# EAGLE design RfLink-ESPlink (EAGLE 8.3.2)
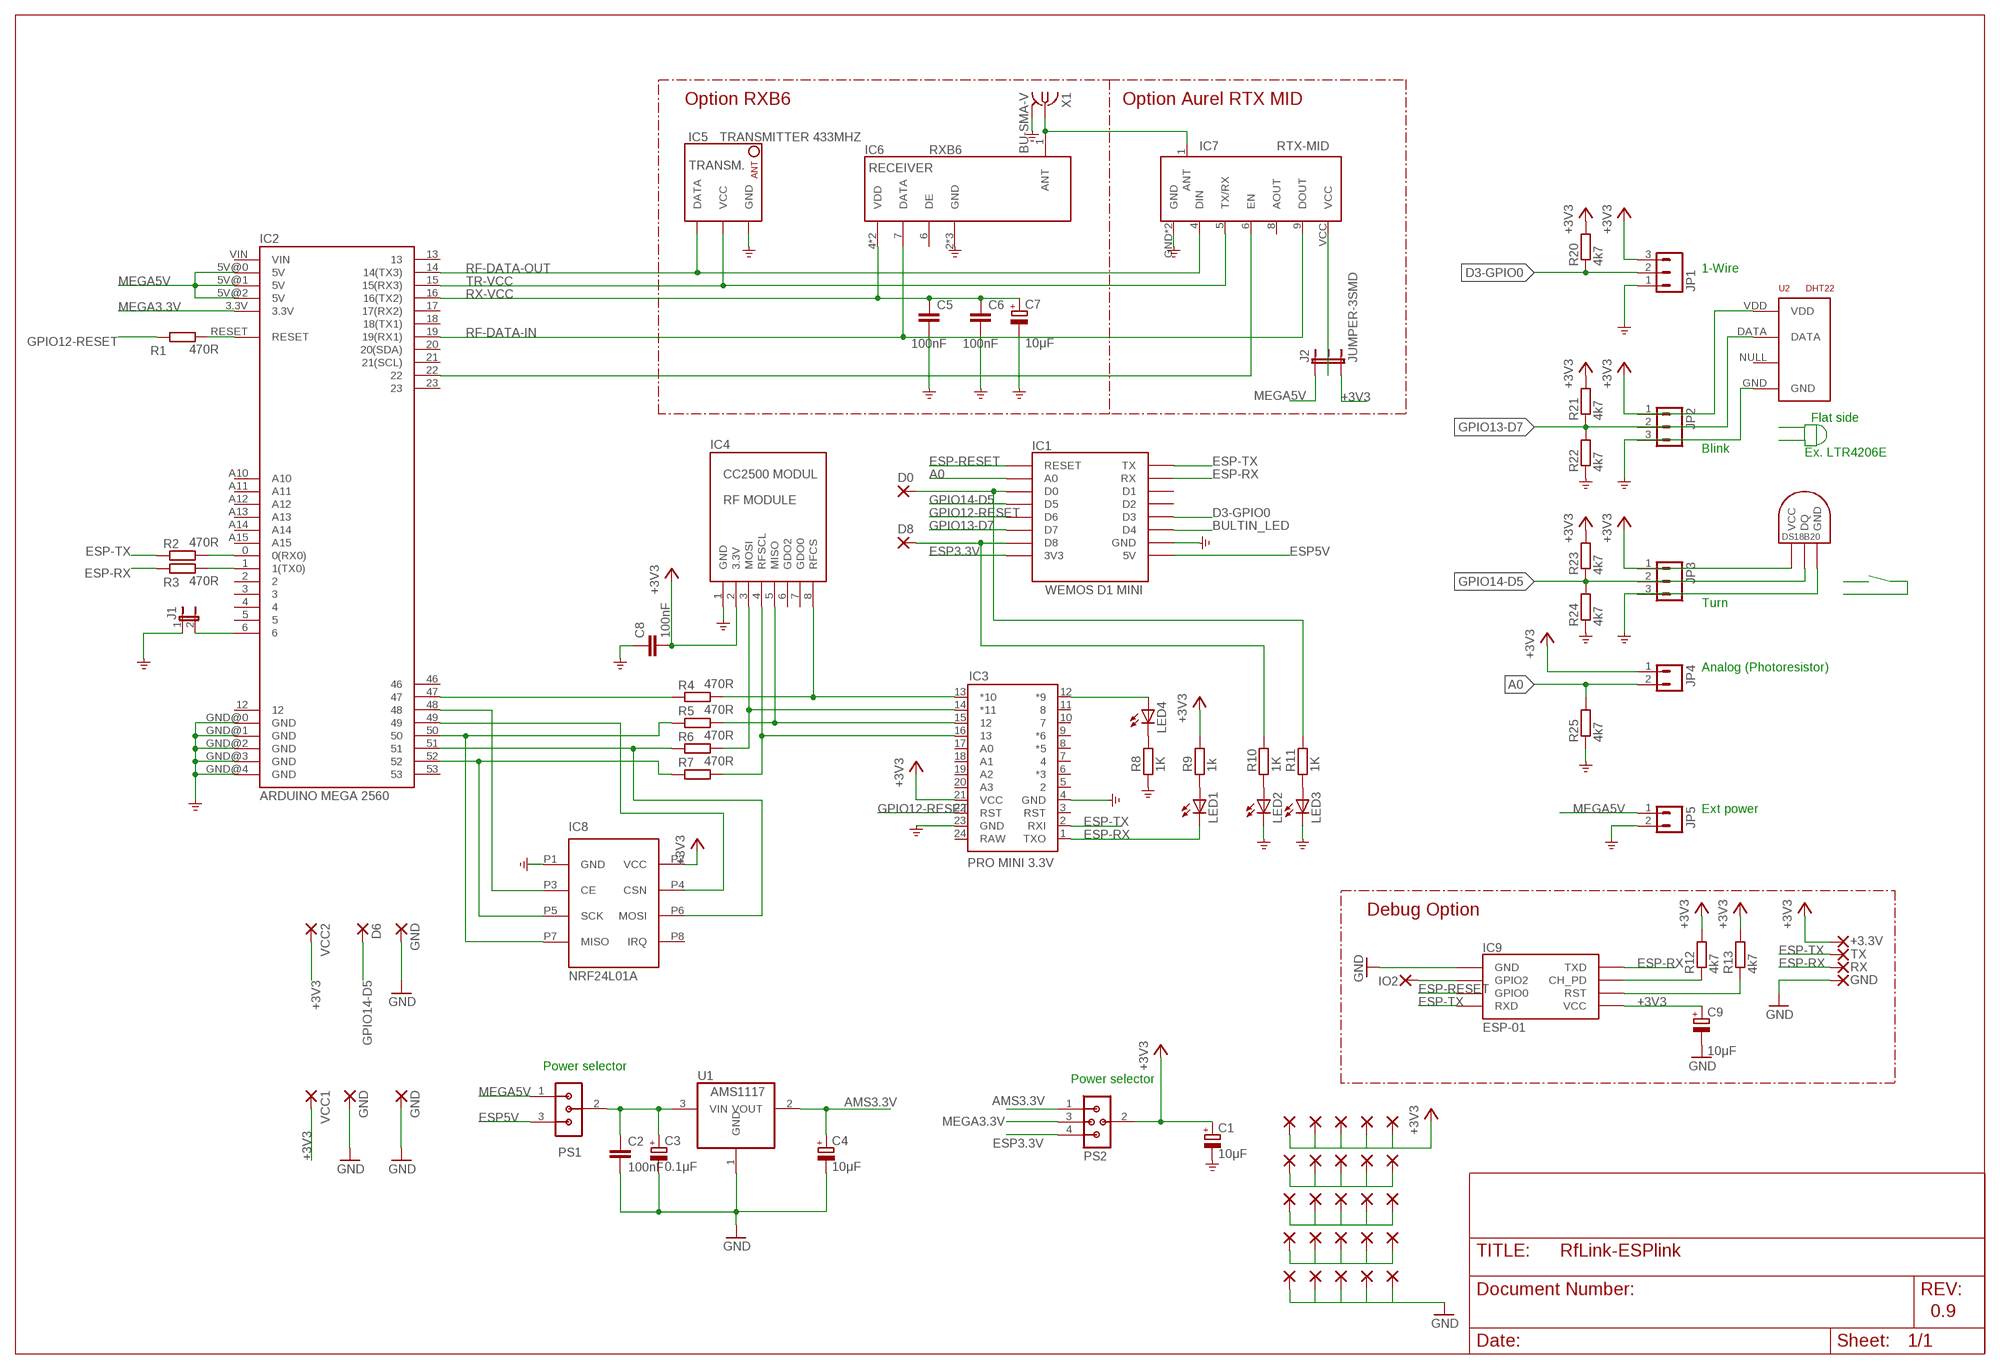
[diagram p0: schematic, sheet 1]

## Parts
+3.3V  1,6/0,9  [1,6/0,9]
C1  10μF  CPOL-EUE2-5  [E2-5]
C2  100nF  CAPACITOR  [C0805]
C3  0.1μF  CPOL-EUE2-5  [E2-5]
C4  10μF  CPOL-EUE2-5  [E2-5]
C5  100nF  CAPACITOR  [C0805]
C6  100nF  CAPACITOR  [C0805]
C7  10μF  CPOL-EUE2-5  [E2-5]
C8  100nF  CAPACITOR  [C0805]
C9  10μF  CPOL-EUE2-5  [E2-5]
D0  1,6/0,9  [1,6/0,9]
D6  D6  1,6/0,9  [1,6/0,9]
D8  1,6/0,9  [1,6/0,9]
G  GND  1,6/0,9  [1,6/0,9]
GND  GND  1,6/0,9  [1,6/0,9]
GND5  GND  1,6/0,9  [1,6/0,9]
GND7  GND  1,6/0,9  [1,6/0,9]
GPIO2  IO2  1,6/0,9  [1,6/0,9]
IC1  WEMOS D1 MINI  WEMOS-D1-MINI  [WEMOS-D1-MINI]
IC2  ARDUINO MEGA 2560  ARDUINO-MEGA-MINI  [ARDUINO_MEGA_MINI]
IC3  PRO MINI 3.3V  ARDUINO_PRO_MINI  [ARDUINO_PRO_MINI]
IC4  CC2500 MODUL  CC2500A-MODULE  [CC2500]
IC5  TRANSMITTER 433MHZ  TRANSMITTER433MHZ  [TRANSMITTER433MHZ]
IC6  RXB6  HXB6-  [RXB6-LOW-SILKSCREEN]
IC7  RTX-MID  [RTX-MID]
IC8  NRF24L01A  [NRF24L01]
IC9  ESP-01  ESP01  [ESP01]
J1  JUMPER-2SMD-NO  [SJ_2S-NO]
J2  JUMPER-3SMD  [SJ_3]
JP1  GS015S-3.81-3P  [GS015S-3.81-3]
JP2  GS015S-3.81-3P  [GS015S-3.81-3]
JP3  GS015S-3.81-3P  [GS015S-3.81-3]
JP4  GS015S-3.81-2P  [GS015S-3.81-2]
JP5  GS015S-3.81-2P  [GS015S-3.81-2]
LED1  LED1206  [LED-1206]
LED2  LED1206  [LED-1206]
LED3  LED1206  [LED-1206]
LED4  LED1206  [LED-1206]
P1  1,6/0,9  [1,6/0,9]
P2  1,6/0,9  [1,6/0,9]
P3  1,6/0,9  [1,6/0,9]
P4  1,6/0,9  [1,6/0,9]
P5  1,6/0,9  [1,6/0,9]
P6  1,6/0,9  [1,6/0,9]
P7  1,6/0,9  [1,6/0,9]
P8  1,6/0,9  [1,6/0,9]
P9  1,6/0,9  [1,6/0,9]
P10  1,6/0,9  [1,6/0,9]
P11  1,6/0,9  [1,6/0,9]
P12  1,6/0,9  [1,6/0,9]
P13  1,6/0,9  [1,6/0,9]
P14  1,6/0,9  [1,6/0,9]
P15  1,6/0,9  [1,6/0,9]
P16  1,6/0,9  [1,6/0,9]
P17  1,6/0,9  [1,6/0,9]
P18  1,6/0,9  [1,6/0,9]
P19  1,6/0,9  [1,6/0,9]
P20  1,6/0,9  [1,6/0,9]
P21  1,6/0,9  [1,6/0,9]
P22  1,6/0,9  [1,6/0,9]
P23  1,6/0,9  [1,6/0,9]
P24  1,6/0,9  [1,6/0,9]
P25  1,6/0,9  [1,6/0,9]
PS1  SV2  2TO1POWER  [2-1]
PS2  3TO1POWER  [3-1]
R1  470R  RESISTORR0805  [R0805]
R2  470R  RESISTORR0805  [R0805]
R3  470R  RESISTORR0805  [R0805]
R4  470R  RESISTORR0805  [R0805]
R5  470R  RESISTORR0805  [R0805]
R6  470R  RESISTORR0805  [R0805]
R7  470R  RESISTORR0805  [R0805]
R8  1K  RESISTORR0805  [R0805]
R9  1k  RESISTORR0805  [R0805]
R10  1K  RESISTORR0805  [R0805]
R11  1K  RESISTORR0805  [R0805]
R12  4k7  RESISTORR0805  [R0805]
R13  4k7  RESISTORR0805  [R0805]
R20  4k7  RESISTORR0805  [R0805]
R21  4k7  RESISTORR0805  [R0805]
R22  4k7  RESISTORR0805  [R0805]
R23  4k7  RESISTORR0805  [R0805]
R24  4k7  RESISTORR0805  [R0805]
R25  4k7  RESISTORR0805  [R0805]
RX  RX  1,6/0,9  [1,6/0,9]
TX  TX  1,6/0,9  [1,6/0,9]
U1  AMS1117  REG1117  [SOT223]
U2  DHT22  RHT03_DHT-22_AM2302  [RHT03_DHT-22]
U3  DS18B20  DS1820TO92  [DS1820]
VCC1  1,6/0,9  [1,6/0,9]
VCC2  1,6/0,9  [1,6/0,9]
X1  BU-SMA-V  [BU-SMA-V]

## Nets
+3V3: +3.3V.1(P) C1.+ C8.2 C9.+ IC3.21(VCC) IC4.2(3.3V) IC8.P2(VCC) IC9.VCC J2.3 JP1.3 JP2.1 JP3.1 JP4.1 P21.1(P) P22.1(P) P23.1(P) P24.1(P) P25.1(P) PS2.2 R9.2 R12.2 R13.2 R20.2 R21.2 R23.2 U2.VDD U3.VDD(VCC) VCC1.1(P) VCC2.1(P)
A0: IC1.A0 JP4.2 R25.2
AMS3.3V: C4.+ PS2.1 U1.2(VOUT)
ANT: IC6.1(ANT) IC7.1(ANT) X1.1
BULTIN_LED: IC1.D4
CC250-ACTIV: IC2.6 J1.2
D3-GPIO0: IC1.D3 JP1.2 R20.1
ESP3.3V: IC1.3V3 PS2.4
ESP5V: IC1.5V PS1.3
ESP-RESET: IC1.RESET IC9.GPIO0
ESP-RX: IC1.RX IC3.1(TXO) IC9.TX(TXD) LED1.C R3.1 RX.1(P)
ESP-TX: IC1.TX IC3.2(RXI) IC9.RX(RXD) R2.2 TX.1(P)
GND: C1.- C2.2 C3.- C4.- C5.1 C6.1 C7.- C8.1 C9.- G.1(P) GND5.1(P) GND7.1(P) GND.1(P) IC1.GND IC2.GND@0(GND) IC2.GND@1(GND) IC2.GND@2(GND) IC2.GND@3(GND) IC2.GND@4(GND) IC3.4(GND) IC3.23(GND) IC4.1(GND) IC5.P$3(GND) IC6.2(GND) IC6.3(GND) IC6.8(GND) IC7.GND IC7.GND1(GND) IC8.P1(GND) IC9.GND J1.1 JP1.1 JP2.3 JP3.3 JP5.2 LED2.C LED3.C P11.1(P) P12.1(P) P13.1(P) P14.1(P) P15.1(P) R8.1 R22.1 R24.1 R25.1 U1.1(GND) U2.GND U3.GND X1.2 X1.3 X1.4 X1.5
GPIO12-RESET: IC1.D6 IC3.22(RST) R1.2
GPIO13-D7: IC1.D7 JP2.2 R21.1 R22.2 U2.DATA
GPIO14-D5: D6.1(P) IC1.D5 JP3.2 R23.1 R24.2 U3.DQ
MEGA3.3V: IC2.3.3V PS2.3
MEGA5V: IC2.5V@0(5V) IC2.5V@1(5V) IC2.5V@2(5V) J2.1 JP5.1 PS1.1
MEGA-RX: IC2.0(0(RX0)) R2.1
MEGA-TX: IC2.1(1(TX0)) R3.2
N$1: IC2.47 R4.1
N$2: IC2.50 IC8.P7(MISO) R5.1
N$3: IC2.51 IC8.P6(MOSI) R6.1
N$4: IC2.52 IC8.P5(SCK) R7.1
N$7: LED3.A R11.1
N$8: D8.1(P) IC1.D8 R10.2
N$9: IC3.14(*11) IC4.3(MOSI) R6.2
N$10: IC2.22 IC7.6(EN)
N$11: IC3.16 IC4.4(RFSCL) R7.2
N$12: IC3.15 IC4.5(MISO) R5.2
N$13: IC3.13(*10) IC4.8(RFCS) R4.2
N$14: IC2.48 IC8.P3(CE)
N$15: IC2.49 IC8.P4(CSN)
N$16: LED1.A R9.1
N$17: LED2.A R10.1
N$18: LED4.C R8.2
N$19: D0.1(P) IC1.D0 R11.2
N$20: IC3.12(*9) LED4.A
N$23: C2.1 C3.+ PS1.2 U1.3(VIN)
N$24: IC9.CH_PD R12.1
N$25: IC7.VCC J2.2
N$26: IC9.RST R13.1
N$27: GPIO2.1(P) IC9.GPIO2
N$28: P1.1(P) P2.1(P) P3.1(P) P4.1(P) P5.1(P)
N$29: P6.1(P) P7.1(P) P8.1(P) P9.1(P) P10.1(P)
N$31: P16.1(P) P17.1(P) P18.1(P) P19.1(P) P20.1(P)
RESET: IC2.RESET R1.1
RF-DATA-IN: IC2.19(19(RX1)) IC6.7(DATA) IC7.9(DOUT)
RF-DATA-OUT: IC2.14(14(TX3)) IC5.P$1(DATA) IC7.4(DIN)
RX-VCC: C5.2 C6.2 C7.+ IC2.16(16(TX2)) IC6.4(VDD) IC6.5(VDD)
TR-VCC: IC2.15(15(RX3)) IC5.P$2(VCC) IC7.5(TX/RX)
Unconnected: IC1.D1 IC1.D2 IC2.2 IC2.3 IC2.4 IC2.5 IC2.12 IC2.13 IC2.17(17(RX2)) IC2.18(18(TX1)) IC2.20(20(SDA)) IC2.21(21(SCL)) IC2.23 IC2.46 IC2.53 IC2.A10 IC2.A11 IC2.A12 IC2.A13 IC2.A14 IC2.A15 IC2.VIN IC3.3(RST) IC3.5 IC3.6(*3) IC3.7 IC3.8(*5) IC3.9(*6) IC3.10 IC3.11 IC3.17(A0) IC3.18(A1) IC3.19(A2) IC3.20(A3) IC3.24(RAW) IC4.6(GDO2) IC4.7(GDO0) IC6.6(DE) IC7.8(AOUT) IC8.P8(IRQ) U2.NULL

## Notes on the sheet
- Option RXB6 | Option Aurel RTX MID
- 1-Wire
- Flat side
- Ex. LTR4206E
- Blink
- Turn
- Analog (Photoresistor)
- Ext power
- Debug Option
- Power selector
- Power selector
- 0.9

## Library data of the parts
+3.3V D0 D6 D8 G GND GND5 GND7 GPIO2 P1-P25 RX TX VCC1 VCC2 = wirepad:1,6/0,9: THROUGH-HOLE PAD
C1 C3 C4 C7 C9 = rcl:CPOL-EU: POLARIZED CAPACITOR, European symbol
C2 C5 C6 C8 = kb20:CAPACITOR
IC1 = esp8266modules:WEMOS-D1-MINI: WeMos.cc D1 mini ESP8266 module
IC2 = SparkFun:ARDUINO-MEGA-MINI
IC3 = SparkFun-ProMini-Simple:ARDUINO_PRO_MINI
IC4 = CC2500A:CC2500A: CC2500A Moduel
IC5 = kb20:TRANSMITTER
IC6 = 433 recivers:HXB6-*
IC7 = radio:RTX-MID
IC8 = ForceTronics:NRF24L01
IC9 = esp8266modules:ESP01: ESP8266 Wifi module 01
J1 = SparkFun:JUMPER-2: Jumper Basic 0.1" spaced jumper. Use with breakaway headers.
J2 = SparkFun:JUMPER-3
JP1-JP3 = kb20:GS015S-3.81-3P: PCB terminal block
JP4 JP5 = kb20:GS015S-3.81-2P: PCB terminal block
LED1-LED4 = SparkFun:LED: LEDs Standard schematic elements and footprints for 5mm, 3mm, 1206, and 0603 sized LEDs. 5mm - Spark Fun Electronics SKU : COM-00529 (and others)
PS1 = powerselect:2TO1POWER
PS2 = powerselect:3TO1POWER
R1-R13 R20-R25 = kb20:RESISTOR
U1 = burr-brown:REG1117: 800mA and 1A Low Dropout (LDO) Positive Regulator 1.8V, 2.5V, 2.85V, 3.3V, 5V, and Adj; MPN: REG1117; OC_FARNELL: 1097566; OC_NEWARK: 14P6981
U2 = RHT03_DHT-22_AM2302:RHT03_DHT-22_AM2302: RHT03 / DHT-22 / AM2302 Packages and symbol for the RHT03 / DHT-22 relative humidity and temperature sensor. Note: The AM2302 is a wired version of the DHT-22 which typically requires less clearance and is thus provided as a separate package.; PROD_ID: SEN-10167
U3 = Ava:DS1820: DS18B20 Programmable Resolution 1-Wire Digital Thermometer Description The DS18B20 digital thermometer provides 9-bit to 12-bit Celsius temperature measurements and has an alarm function with nonvolatile user-programmable upper and lower trigger points. The DS18B20 communicates over a 1-Wire® bus that by definition requires only one data line (and ground) for communication with a central microprocessor. It has an operating temperature range of -55°C to +125°C and is accurate to ±0.5°C over the range of -10°C to +85°C. In addition, the DS18B20 can derive power directly from the data line ("parasite power"), eliminating the need for an external power supply. Each DS18B20 has a unique 64-bit serial code, which allows multiple DS18B20s to function on the same 1-Wire bus. Thus, it is simple to use one microprocessor to control many DS18B20s distributed over a large area. Applications that can benefit from this feature include HVAC environmental controls, temperature monitoring systems inside buildings, equipment, or machinery, and process monitoring and control systems.
X1 = con-coax:BU-SMA-V: FEMALE SMA CONNECTOR Radiall distributor RS 112-3794; OC_FARNELL: unknown; OC_NEWARK: unknown

## Board
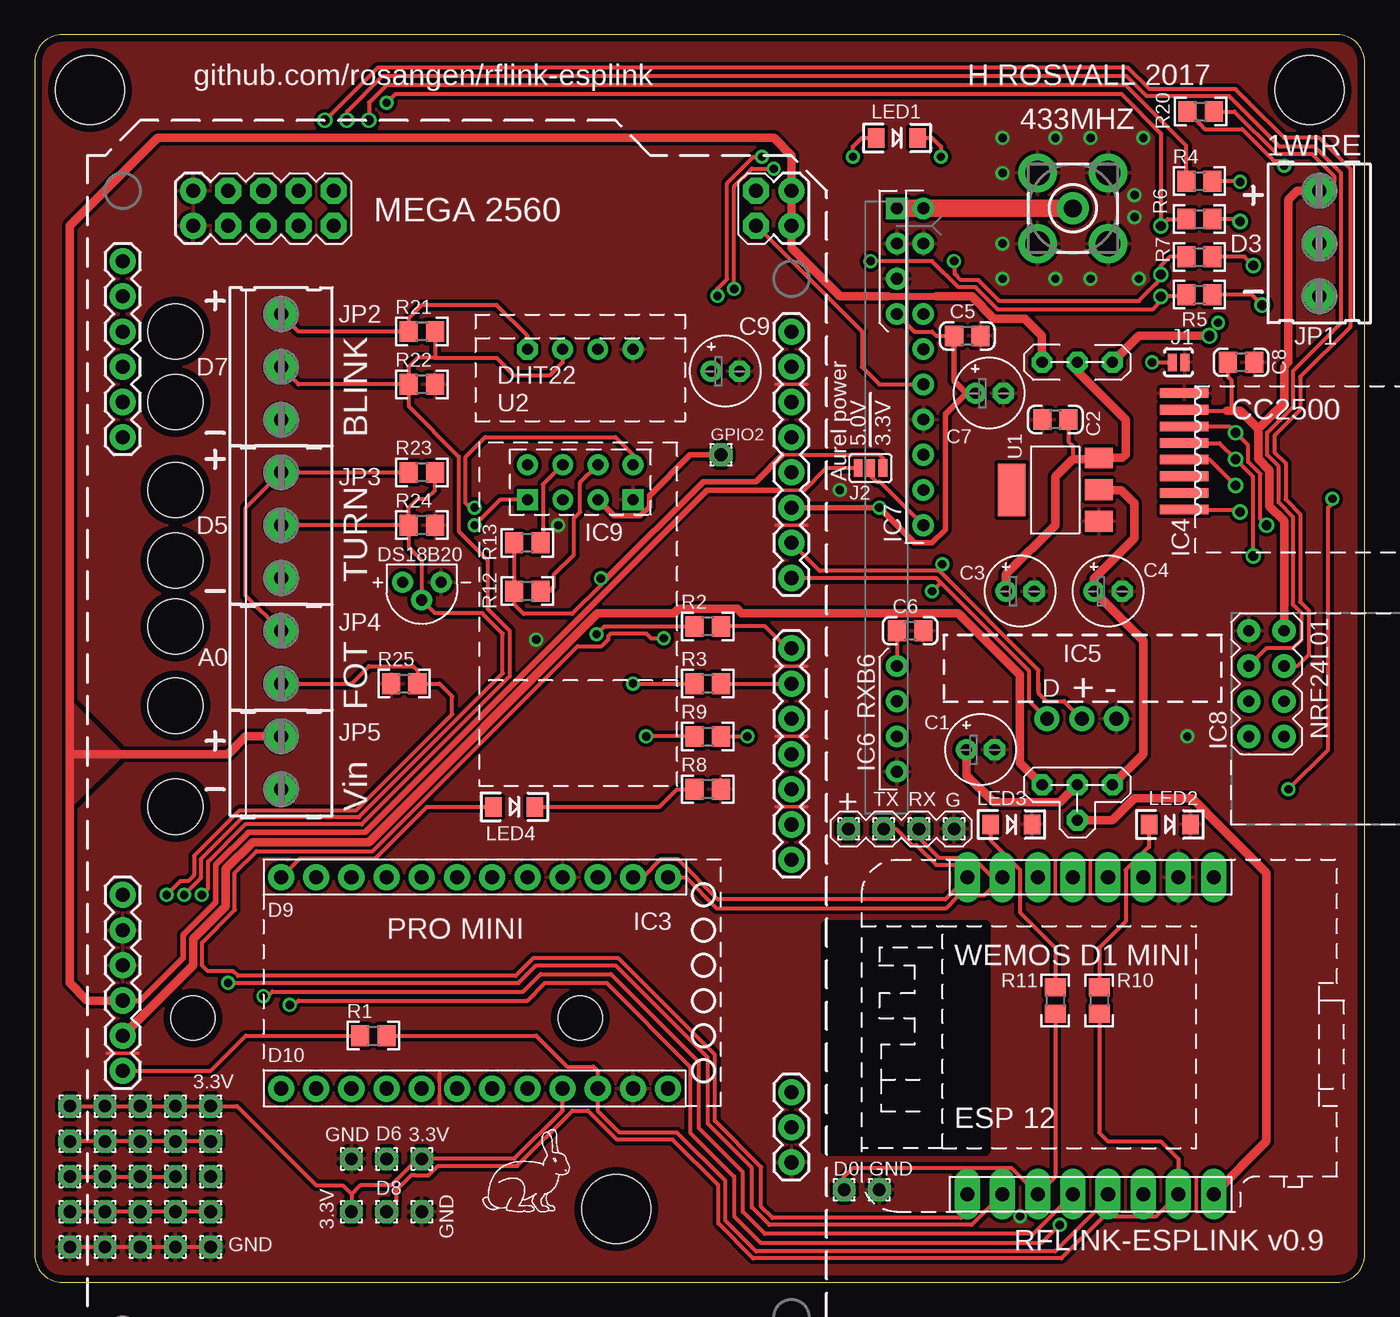
[diagram p1: board, top side]
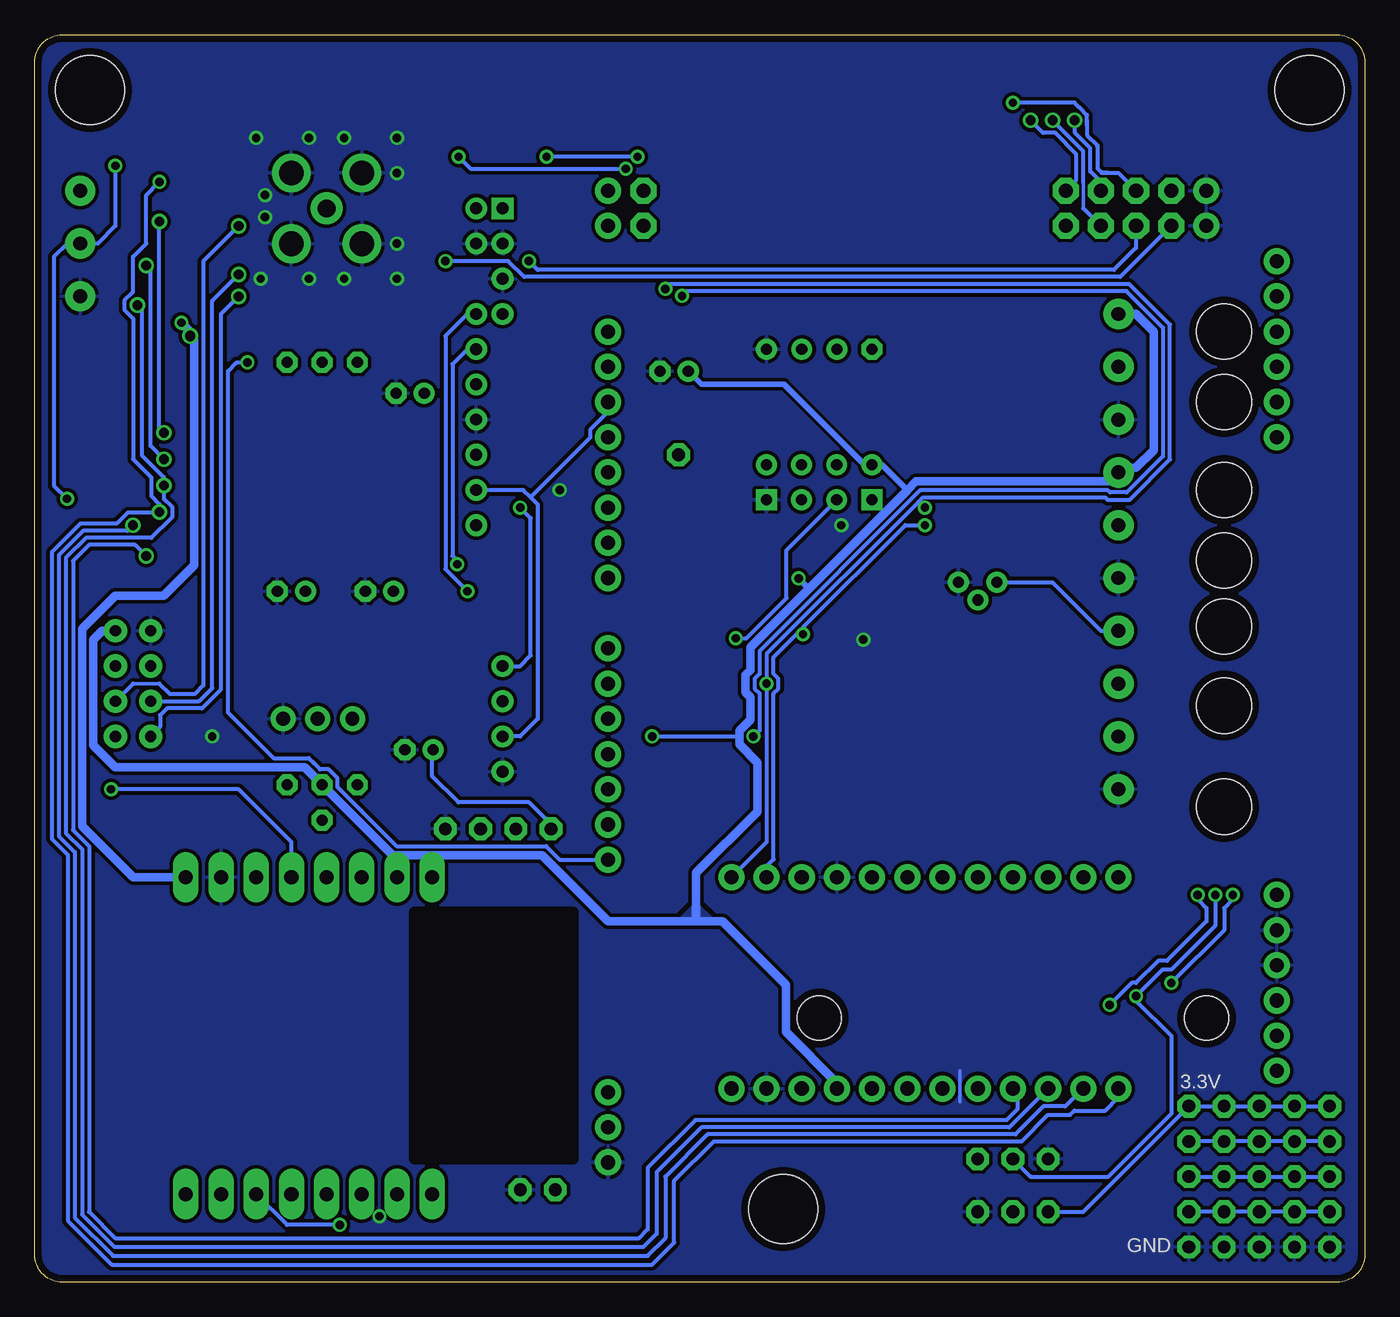
[diagram p2: board, bottom side, seen from below]

Size 96 x 90 mm. Coordinates in mm from the lower left corner, seen from the top.
Outline: 0,88 0,2 arc90 2,0 94,0 arc90 96,2 96,88 arc90 94,90 2,90 arc90 0,88
Copper layers (1*16): Top 0.035mm / dielectric 1.6mm / Bottom 0.035mm
Design rules "Elecrow_2-layer_PCB_eagle_rule *": minimum track width 10mil, minimum drill 0.599440625mm, track to track 8mil, track to pad 8mil, pad to pad 8mil, via to via 8mil, smd to smd 8mil, copper to edge 20mil, drill to drill 10mil, minimum pad ring 14mil, minimum via ring 8mil, stop-mask expansion 0mil, vias tented up to drill 100mil, thermal gap 10mil
Holes 5 mm at 4,86 92,86 41.97,5.27
Holes 4 mm at 10.16,68.58 10.16,63.5 10.16,57.15 10.16,52.07 10.16,47.31 10.16,41.59 10.16,34.29
Holes 3.2 mm at 11.43,19.05 39.37,19.05
tRestrict: area 57.1,9.5 to 68.6,25.7
bRestrict: area 57.1,8.9 to 68.6,26.7

### Footprints (pad centres in the part's own frame; a part is rotated, then mirrored left to right if it is on the bottom)
1,6/0,9 = drill 0.914 pad 1.6 octagon: 1 0,0
E2-5 = drill 0.813 pad 1.27: + -1.016,0 | drill 0.813 pad 1.27 octagon: - 1.016,0
C0805 = smd 1.3 x 1.5: 1 -0.95,0; 2 0.95,0
WEMOS-D1-MINI = drill 1.016 pad 1.829 long: 3V3 -10.16,-10.16; 5V 12.7,-10.16; A0 -10.16,5.08; D0 -10.16,2.54; D1 12.7,2.54; D2 12.7,0; D3 12.7,-2.54; D4 12.7,-5.08; D5 -10.16,0; D6 -10.16,-2.54; D7 -10.16,-5.08; D8 -10.16,-7.62; GND 12.7,-7.62; RESET -10.16,7.62; RX 12.7,5.08; TX 12.7,7.62
ARDUINO_MEGA_MINI = drill 1.016 pad 1.88: 0 63.5,2.54; 1 60.96,2.54; 2 58.42,2.54; 3 55.88,2.54; 3.3V 35.56,50.8; 4 53.34,2.54; 5 50.8,2.54; 5V@0 38.1,50.8; 5V@1 93.98,2.54; 5V@2 96.52,2.54; 6 48.26,2.54; 12 31.496,2.54; 13 28.956,2.54; 14 68.58,2.54; 15 71.12,2.54; 16 73.66,2.54; 17 76.2,2.54; 18 78.74,2.54; 19 81.28,2.54; 20 83.82,2.54; 21 86.36,2.54; A10 78.74,50.8; A11 81.28,50.8; A12 83.82,50.8; A13 86.36,50.8; A14 88.9,50.8; A15 91.44,50.8; GND@0 40.64,50.8; GND@1 43.18,50.8; GND@2 93.98,45.72; GND@3 96.52,45.72; GND@4 26.416,2.54; RESET 33.02,50.8; VIN 45.72,50.8 | drill 1.016 pad 1.88 octagon: 22 93.98,5.08; 23 96.52,5.08; 46 93.98,35.56; 47 96.52,35.56; 48 93.98,38.1; 49 96.52,38.1; 50 93.98,40.64; 51 96.52,40.64; 52 93.98,43.18; 53 96.52,43.18
ARDUINO_PRO_MINI = drill 1.016 pad 1.88: 1 -7.62,12.7; 2 -7.62,10.16; 3 -7.62,7.62; 4 -7.62,5.08; 5 -7.62,2.54; 6 -7.62,0; 7 -7.62,-2.54; 8 -7.62,-5.08; 9 -7.62,-7.62; 10 -7.62,-10.16; 11 -7.62,-12.7; 12 -7.62,-15.24; 13 7.62,-15.24; 14 7.62,-12.7; 15 7.62,-10.16; 16 7.62,-7.62; 17 7.62,-5.08; 18 7.62,-2.54; 19 7.62,0; 20 7.62,2.54; 21 7.62,5.08; 22 7.62,7.62; 23 7.62,10.16; 24 7.62,12.7
CC2500 = smd 0.7 x 3.5: 1 -5.5,-6.8; 2 -4.3,-6.8; 3 -3.1,-6.8; 4 -1.9,-6.8; 5 -0.7,-6.8; 6 0.5,-6.8; 7 1.7,-6.8; 8 2.9,-6.8
TRANSMITTER433MHZ = drill 1: P$1 -2.5,0; P$2 0,0; P$3 2.5,0
RXB6-LOW-SILKSCREEN = drill 0.85 square: 1 -20.32,0 | drill 0.85: 2 -17.78,0; 3 -15.24,0; 4 -12.7,0; 5 12.7,0; 6 15.24,0; 7 17.78,0; 8 20.32,0
RTX-MID = drill 0.85: 1 -11.43,0; 4 -3.81,0; 5 -1.27,0; 6 1.27,0; 8 6.35,0; 9 8.89,0; GND -8.89,0; GND1 3.81,0; VCC 11.43,0
NRF24L01 = drill 0.8 pad 1.676: P1 13.97,-1.27; P2 13.97,-3.81; P3 11.43,-1.27; P4 11.43,-3.81; P5 8.89,-1.27; P6 8.89,-3.81; P7 6.35,-1.27; P8 6.35,-3.81
ESP01 = drill 0.8: CH_PD -1.285,-8.178; GPIO0 1.255,-5.638; GPIO2 -1.285,-5.638; RST 1.255,-8.178; TX -3.825,-8.178; VCC 3.795,-8.178 | drill 0.8 square: GND -3.825,-5.638; RX 3.795,-5.638
SJ_2S-NO = smd 0.635 x 1.27: 1 -0.45,0; 2 0.45,0
SJ_3 = smd 0.635 x 1.27: 1 -0.889,0; 2 0,0; 3 0.889,0
GS015S-3.81-3 = drill 1 pad 2.184: 1 0,0; 2 3.81,0; 3 7.62,0
GS015S-3.81-2 = drill 1 pad 2.184: 1 0,0; 2 3.81,0
LED-1206 = smd 1.2 x 1.4: A -1.5,0; C 1.5,0
2-1 = drill 0.8 octagon: 1 -2.54,0; 2 0,0; 3 2.54,0
3-1 = drill 0.8 octagon: 1 0,2.54; 2 0,0; 3 0,-2.54; 4 2.54,0
R0805 = smd 1.3 x 1.5: 1 -0.95,0; 2 0.95,0
SOT223 = smd 1.499 x 2.007: 1 -2.261,-3.15; 2 0.025,-3.15; 3 2.311,-3.15 | smd 3.81 x 2.007: 4 0,3.15
RHT03_DHT-22 = drill 0.8: DATA -1.27,0; GND 3.81,0; NULL 1.27,0 | drill 0.8 octagon: VDD -3.81,0
DS1820 = drill 0.8: DQ 0,1.27; GND -1.397,0; VDD 1.397,0
BU-SMA-V = drill 1.27: 1 0,0 | drill 1.778: 2 -2.55,2.55; 3 2.55,2.55; 4 2.55,-2.55; 5 -2.55,-2.55

### Placement (x,y rotation side)
+3.3V  22.86,5.08 0 top
C1  68.26,38.42 0 top
C2  73.66,62.23 180 top
C3  71.12,49.85 0 top
C4  77.47,49.85 0 top
C5  67.31,68.26 180 top
C6  63.18,46.99 180 top
C7  68.9,64.14 0 top
C8  87.07,66.36 180 top
C9  49.85,65.72 0 top
D0  58.42,6.67 0 top
D6  25.4,8.89 0 top
D8  25.4,5.08 0 top
G  27.94,5.08 0 top
GND  60.96,6.67 0 top
GND5  66.36,32.7 0 top
GND7  22.86,8.89 0 top
GPIO2  49.53,59.69 0 top
IC1  74.93,16.51 90 top
IC2  57.15,-17.78 90 top
IC3  33.02,21.59 270 top
IC4  89.77,58.64 270 top
IC5  75.56,40.64 0 top
IC6  62.23,57.15 270 top
IC7  64.14,66.04 270 top
IC8  86.36,33.02 90 top
IC9  39.37,50.8 180 top
J1  82.55,66.36 180 top
J2  60.33,58.74 0 top
JP1  92.71,71.12 90 top
JP2  17.78,69.85 270 top
JP3  17.78,58.42 270 top
JP4  17.78,46.99 270 top
JP5  17.78,39.37 270 top
LED1  62.23,82.55 0 top
LED2  81.92,33.02 0 top
LED3  70.48,33.02 0 top
LED4  34.61,34.29 0 top
P1  2.54,7.62 0 top
P2  5.08,7.62 0 top
P3  7.62,7.62 0 top
P4  10.16,7.62 0 top
P5  12.7,7.62 0 top
P6  2.54,5.08 0 top
P7  10.16,5.08 0 top
P8  5.08,5.08 0 top
P9  7.62,5.08 0 top
P10  12.7,5.08 0 top
P11  2.54,2.54 0 top
P12  5.08,2.54 0 top
P13  7.62,2.54 0 top
P14  12.7,2.54 0 top
P15  10.16,2.54 0 top
P16  2.54,10.16 0 top
P17  5.08,10.16 0 top
P18  7.62,10.16 0 top
P19  10.16,10.16 0 top
P20  12.7,10.16 0 top
P21  2.54,12.7 0 top
P22  5.08,12.7 0 top
P23  12.7,12.7 0 top
P24  10.16,12.7 0 top
P25  7.62,12.7 0 top
PS1  75.25,66.36 0 top
PS2  75.25,35.88 270 top
R1  24.45,17.78 0 top
R2  48.58,47.31 180 top
R3  48.58,43.18 0 top
R4  84.05,79.43 0 top
R5  84.05,71.24 0 top
R6  84.05,76.7 0 top
R7  84.05,73.97 0 top
R8  48.58,35.56 180 top
R9  48.58,39.37 0 top
R10  76.83,20.32 270 top
R11  73.66,20.32 270 top
R12  35.56,49.85 180 top
R13  35.56,53.34 180 top
R20  84.14,84.45 0 top
R21  27.94,68.58 180 top
R22  27.94,64.77 180 top
R23  27.94,58.42 180 top
R24  27.94,54.61 180 top
R25  26.67,43.18 0 top
RX  63.82,32.7 0 top
TX  61.28,32.7 0 top
U1  73.66,57.15 90 top
U2  39.37,67.31 0 top
U3  27.94,50.48 180 top
U$28  [RABBIT-SILK]  32.07,4.76 0 top
VCC1  58.74,32.7 0 top
VCC2  27.94,8.89 0 top
X1  74.93,77.47 0 top

### Tracks (layer width: path | path; a pad name or v marks a point on that pad's centre or on a via)
+3V3  (via drill 0.6)
  Top 0.254: 53.98,59.69 55.56,59.69
  Top 0.305: IC4.2 83.05,62.87 86.36,62.87 86.36,65.09 86.12,65.33 C8.2 | R23.2 JP3.1 15.24,55.88 15.24,49.53 JP4.1 | R21.2 | R21.2 19.05,68.58 JP2.1 | R9.2 v51.44,39.37 | IC3.21 38.1,12.38 34.61,8.89 VCC2.1 27.62,8.89 25.72,6.99 23.5,6.99 22.86,6.35 | U2.VDD 35.56,68.26 33.34,70.48 27.94,70.48 26.99,69.53 R21.2 | R20.2 86.59,84.45 89.64,81.41 92.18,81.41 93.79,79.8 93.79,79.38 93.15,78.74 JP1.3 | v40.86,50.78 40.86,50.28 38.79,48.21 35.3,48.21 34.61,48.9 R12.2 | R12.2 | R12.2 34.61,50.74 34.61,50.75 R13.2 | 22.86,6.35 +3.3V.1 | P21.1 P22.1 P25.1 P24.1 P23.1 14.61,12.7 20.32,6.99 22.23,6.99 22.86,6.35 | J2.3 61.28,58.8 61.28,59.37 60.92,59.73 58.97,59.73 58.93,59.69 55.56,59.69
  Top 0.406: v40.86,50.78 41.29,50.78 48.27,57.76 52.05,57.76 53.98,59.69
  Top 0.61: 86.04,62.87 86.36,62.87 87,62.87 88.3,61.56 | PS2.2 73.98,34.61 69.22,34.61 67.25,36.58 C1.+ | 88.3,61.56 88.3,59.41 89.12,58.59 89.12,55.98 90.17,54.93 IC8.P2 | 88.3,61.56 90.17,63.44 90.17,66.04 90.49,66.36 90.49,78.11 91.12,78.74 JP1.3
  Bottom 0.305: U3.VDD 22.54,50.48 19.05,46.99 JP4.1 | v51.44,39.37 45.14,39.37 | 67.31,38.35 67.31,36.51 65.41,34.61 60.33,34.61 58.74,33.02 VCC1.1 | +3.3V.1 20.32,5.08 P23.1 P21.1
  Bottom 0.406: v40.86,50.78 40.16,50.08 40.16,50.01 | 33.02,57.15 34.85,58.98 IC9.VCC 36.12,58.98 41.91,64.77 47.88,64.77 C9.+
  Bottom 0.61: JP2.1 16.51,69.85 15.24,68.58 15.24,60.01 16.51,58.74 17.46,58.74 JP3.1 18.41,57.78 32.38,57.78 33.02,57.15 40.16,50.01 40.16,49.99 44.35,45.8 44.35,44.16 44.7,43.81 44.7,42.55 44.35,42.2 44.35,40.58 45.14,39.79 45.14,39.37 45.14,38.79 43.84,37.49 43.84,33.95 48.26,29.53 48.26,26.04 | 48.26,26.04 54.61,26.04 59.37,30.8 70.17,30.8 PS2.2 76.52,37.15 90.17,37.15 91.76,38.73 91.76,46.35 91.12,46.99 IC8.P2 | C1.+ 67.31,38.35 | 48.26,26.04 46.35,26.04 41.78,21.46 41.78,18.05 38.1,14.37 IC3.21
  pour Bottom (isolate 0.305): 48.26,27.3 49.53,26.04 47.31,26.04 46.99,26.04
A0  (via drill 0.6)
  Top 0.305: IC1.A0 67.63,4.13 53.02,4.13 51.75,5.4 51.75,8.26 48.58,11.43 48.58,16.19 41.91,22.86 36.2,22.86 34.92,21.59 v13.97,21.59 | 9.58,28 v9.53,27.94 10.52,28.93 11.07,28.93 11.51,29.37 11.51,30.76 14.79,34.04 23.18,34.04 30.13,40.99 30.13,42.26 29.21,43.18 R25.2 | R25.2 | JP4.2 22.86,43.18 24.13,44.45 27.3,44.45 27.62,44.13 R25.2
  Bottom 0.305: v9.53,27.94 9.53,27.62 10.16,26.99 10.16,25.4 v13.97,21.59
AMS3.3V
  Top 0.61: U1.2 76.83,57.15 78.42,57.15 79.38,56.2 79.38,53.66 76.45,50.74 C4.+ 80.01,46.29 80.01,38.1 PS2.1
ANT
  Top 0.813: IC7.1 IC6.1
  Top 1.27: IC6.1 X1.1
CC250-ACTIV  (via drill 0.6)
  Top 0.305: v80.64,66.36 J1.2
  Bottom 0.305: v80.64,66.36 81.41,66.36 82.04,65.72 82.04,41.08 78.77,37.81 76.22,37.81 75.88,37.47 | 75.88,37.47 75.9,37.47 | 75.88,37.47 75.41,36.99 74.79,36.99 74.14,36.34 74.14,35.72 72.43,34.02 72.43,34 69.89,31.46 59.08,31.46 58.1,30.48 IC2.6
D3-GPIO0  (via drill 0.6)
  Top 0.305: v93.66,56.52 93.66,56.2 93.34,55.88 93.34,38.42 v90.49,35.56 | R20.1 84.08,83.56 84.45,83.19 87.15,83.19 89.43,80.9 89.85,80.9 90.17,80.58 v90.17,80.55
  Bottom 0.305: v93.66,56.52 94.61,57.47 94.61,73.98 93.66,74.93 JP1.2 91.44,74.93 90.17,76.2 v90.17,80.55 | IC1.D3 77.47,31.75 81.28,35.56 v90.49,35.56
ESP3.3V
  Top 0.61: IC1.3V3 88.9,10.16 88.9,29.53 84.52,33.9 84.52,33.93 83.55,34.9 79.35,34.9 77.79,33.34 PS2.4
ESP5V  (via drill 0.6, 0.75)
  Top 0.61: v84.77,68.26 79.69,68.26 PS1.3
  Bottom 0.305: v84.77,68.26 84.77,68.58
  Bottom 0.61: IC1.5V 88.9,29.21 92.57,32.88 92.57,47.13 90.17,49.53 86.68,49.53 84.48,51.73 84.48,67.97 v84.77,68.26 | 84.77,68.58 v85.41,69.22
ESP-RESET  (via drill 0.6)
  Top 0.305: IC1.RESET 67.31,5.08 66.86,4.64 53.23,4.64 52.43,5.44 52.43,8.3 49.09,11.64 49.09,16.4 42.12,23.37 35.98,23.37 34.72,22.1 14.68,22.1 14.33,22.45 12.48,22.45 12.09,22.84 12.09,24.49 14.45,26.85 14.45,29.54 16.01,31.09 24.4,31.09 39.19,45.88 40.9,45.88 41.41,46.38 41.41,46.61 41.59,46.8 44.13,46.8 44.48,46.45 v45.4,46.45
  Bottom 0.305: v45.4,46.45 44.64,46.45 41.73,49.35 41.73,52.82 IC9.GPIO0
ESP-RX  (via drill 0.6)
  Top 0.305: 63.82,82.64 LED1.C 64.77,82.55 65.41,81.92 v65.41,81.19 | v43.18,43.18 R3.1 | v31.75,55.88 31.43,55.88 31.11,56.2 31.11,59.56 32.51,60.96 41.91,60.96 43.18,59.69 43.18,58.99 IC9.TX | RX.1 63.82,32.07 65.09,30.8 | 65.28,30.61 65.09,30.8 | v53.34,80.33 51.75,80.33 50.48,79.06 v50.48,71.66 | IC3.1 46.99,29.21 49.21,26.99 65.81,26.99 66.72,27.9 68.54,27.9 IC1.RX 69.11,29.21 67.71,30.61 65.28,30.61 | 65.09,30.8 65.28,30.61
  Bottom 0.305: 32.19,56.31 43.18,45.32 v43.18,43.18 43.18,31.75 IC3.1 | 32.19,56.31 31.88,56.62 18.74,56.62 18.59,56.46 16.97,56.46 14.07,59.36 14.07,69.08 17,72.01 50.16,72.01 50.16,71.98 v50.48,71.66 | v31.75,55.88 32.19,56.31 | v65.41,81.19 64.55,80.33 v53.34,80.33
ESP-TX  (via drill 0.6)
  Top 0.305: v40.55,46.74 41.12,47.31 R2.2 | TX.1 62.15,32.7 63.33,31.52 63.64,31.52 65.07,30.1 66.67,30.1 67.31,29.46 IC1.TX 65.72,27.62 49.3,27.62 46.41,30.5 45.18,30.5 43.89,29.21 IC3.2 | IC9.RX 33.58,56.44 v31.75,54.61
  Bottom 0.305: 42.67,30.5 42.64,30.5 | 42.67,30.5 42.67,42.47 42.32,42.82 42.32,43.54 42.67,43.89 42.67,45.09 40.96,46.8 40.96,46.82 40.87,46.74 v40.55,46.74 40.55,47.23 33.17,54.61 v31.75,54.61 | IC3.2 43.18,30 42.67,30.5
GND  (via drill 0.6)
  Top 0.254: 53.5,44.45 55.72,44.45 | 73.66,28.1 73.66,30.32 | 76.2,28.1 76.2,30.32 | 53.5,54.61 55.72,54.61 | 53.5,64.77 55.72,64.77 | 53.5,39.37 55.72,39.37 | 53.5,34.29 55.72,34.29 | 5.24,16.51 7.46,16.51 | 29.21,12.86 29.21,15.08 | 83.82,5.24 83.82,7.46
  Top 0.305: P11.1 P12.1 P13.1 P15.1 P14.1
  Bottom 0.254: 29.21,15.24 29.21,13.02
  other vias: 71.12,4.76 69.85,80.01 69.85,82.55 73.66,82.55 76.2,82.55 79.38,78.42 79.38,76.83 80.01,82.55 79.69,72.39 76.2,72.39 73.66,72.39 69.85,72.39 69.85,74.93 83.19,39.37 36.2,46.35 58.1,57.15 37.78,54.61
  pour Bottom (isolate 0.254, rank 3): -2.54,-2.54 101.97,-2.54 101.97,93.08 -2.54,93.08
  pour Top (isolate 0.254, rank 2): -1.27,-1.27 100.7,-1.27 100.7,91.81 -1.27,91.81
GPIO12-RESET
  Top 0.305: IC1.D6 77.47,6.03 73.66,2.22 52.07,2.22 49.85,4.45 49.85,7.3 46.35,10.79 42.23,10.79 40.64,12.38 IC3.22 40.64,15.24 40.32,15.56 38.42,15.56 36.2,17.78 R1.2
GPIO13-D7  (via drill 0.6)
  Top 0.305: v18.41,20 18.73,20 19.05,20.32 35.56,20.32 36.83,21.59 41.27,21.59 47.31,15.56 47.31,10.79 50.48,7.62 50.48,4.76 52.39,2.86 72.71,2.86 v73.98,4.13 | R22.2 26.99,66.04 27.62,66.67 28.89,66.67 | R21.1 | U2.DATA 38.1,66.36 37.15,65.41 34.61,65.41 33.34,66.67 28.89,66.67 | R21.1 | v12.06,27.94 12.52,28.4 12.52,30.34 15.21,33.02 23.6,33.02 34.29,43.71 34.29,46.99 32.7,48.58 32.7,52.07 30.61,54.17 30.61,59.56 26.99,63.18 R22.2 | 26.67,64.45 R22.2 | R22.2 19.05,64.77 JP2.2 | R21.1 28.89,66.67
  Bottom 0.305: v12.06,27.94 12.06,27.62 11.43,26.99 11.43,26.04 14.29,23.18 14.92,23.18 16.51,21.59 16.83,21.59 v18.41,20 | v73.98,4.13 77.79,4.13 IC1.D7
GPIO14-D5  (via drill 0.6)
  Top 0.305: IC1.D5 72.07,3.49 52.7,3.49 51.12,5.08 51.12,7.94 47.94,11.11 47.94,15.88 41.59,22.23 36.51,22.23 35.24,20.95 17.14,20.95 16.83,20.64 v16.51,20.64 | R24.2 26.99,55.88 27.62,56.52 28.26,56.52 28.89,57.15 R23.1 | R24.2 | R24.2 JP3.2 | v10.79,27.94 12.01,29.16 12.01,30.55 15,33.53 23.39,33.53 33.78,43.92 33.78,46.78 32.3,48.26 28.89,48.26 U3.DQ 27.94,52.07 26.99,53.02 R24.2
  Bottom 0.305: v10.79,27.94 10.79,25.72 13.97,22.54 14.61,22.54 v16.51,20.64 16.51,20.32 13.95,17.75 13.95,12.17 18.5,7.62 24.13,7.62 D6.1
MEGA3.3V
  Top 0.61: PS2.3 71.12,37.47 71.12,43.81 66.67,48.26 51.01,48.26 50.7,48.57 46.45,48.57 46.14,48.26 40.64,48.26 24.13,31.75 15.73,31.75 13.79,29.81 13.79,27.13 11.43,24.77 11.43,22.86 IC2.3.3V
MEGA5V
  Top 0.254: 53.66,57.15 55.56,57.15
  Top 0.305: 55.56,57.15 57.15,58.74 J2.1
  Top 0.406: 53.66,57.15 48.52,57.15 23.84,32.46 15.44,32.46 13.08,30.1 13.08,27.42 10.72,25.06 10.72,23.42 7.62,20.32 IC2.5V@0
  Top 0.508: 61.59,71.12 65.09,71.12
  Top 0.61: IC2.5V@0 3.81,20.32 2.54,21.59 2.54,38.1 | 2.54,38.1 2.54,76.2 8.89,82.55 53.34,82.55 54.61,81.28 IC2.5V@2 IC2.5V@1 54.61,74.61 58.1,71.12 61.59,71.12 | PS1.1 72.71,68.26 71.46,69.51 69.24,69.51 67.63,71.12 65.09,71.12 | JP5.1 15.24,39.37 13.97,38.1 2.54,38.1
  pour Top (isolate 0.305): 2.54,41.91 6.35,38.1 2.54,34.29
MEGA-RX
  Top 0.305: IC2.0 54.29,45.72 52.7,47.31 R2.1
MEGA-TX
  Top 0.305: R3.2 IC2.1
N$1  (via drill 0.7)
  Top 0.305: R4.1 83.1,82 78.74,86.36 25.4,86.36 24.13,85.09 v24.13,83.82
  Bottom 0.305: IC2.47 20.83,79.5 20.83,81.39 22.35,82.91 23.22,82.91 v24.13,83.82
N$2  (via drill 0.6, 0.7)
  Top 0.305: v60.33,73.66 64.77,73.66 66.65,71.78 67.9,71.78 69.51,70.17 80.64,70.17 81.28,70.8 v81.28,71.12 82.98,71.12 R5.1
  Bottom 0.305: IC2.50 16.51,74.61 18.1,73.03 59.69,73.03 v60.33,73.66 | IC8.P7 86.94,40.05 86.94,40.91 86.45,41.4 83.93,41.4 82.55,42.78 82.55,69.85 v81.28,71.12
N$3  (via drill 0.6, 0.7)
  Top 0.305: 83.1,76.92 R6.1 81.78,76.7 v81.28,76.2 81.28,82.87 78.42,85.72 26.04,85.72 v25.4,85.09
  Bottom 0.254: 87,43.18 88.9,43.18
  Bottom 0.305: IC8.P6 88.9,43.18 | v81.28,76.2 83.82,73.66 83.82,43.05 84.45,42.42 86.23,42.42 87,43.18 | 18.51,80.03 18.99,80.03 | 18.99,80.03 19.3,80.35 19.3,81.92 | 19.3,81.92 19.3,82.02 | 20.05,83.44 20.05,83.82 | 20.05,83.82 20.05,84.2 20.58,84.73 20.59,84.73 20.95,85.09 v25.4,85.09 | 20.05,83.82 20.05,82.76 19.3,82.02 | 19.3,82.02 19.3,81.92 | 18.99,80.03 17.8,80.03 IC2.51
N$4  (via drill 0.6, 0.7)
  Top 0.305: R7.1 81.91,73.97 81.28,73.34 v81.28,72.71 81.28,72.39 80.92,72.03 80.9,72.03 80.37,71.5 80.37,71.48 79.69,70.8 69.6,70.8 68.11,72.29 66.86,72.29 66.4,72.75 66.4,73.62 v66.36,73.66
  Bottom 0.305: IC8.P5 84.14,41.91 83.19,42.86 83.19,70.8 v81.28,72.71 | v66.36,73.66 61.82,73.66 60.68,72.52 17.65,72.52 IC2.52
N$6
  pour Top: 52.07,78.74 54.61,78.74 54.61,76.2 52.07,76.2
N$7
  Top 0.305: R11.1 73.66,24.13 71.12,26.67 71.12,29.74 68.98,31.87 LED3.A
N$8
  Top 0.305: R10.2 76.83,10.79 77.47,10.16 81.28,10.16 82.55,8.89 IC1.D8 80.96,4.76 77.15,4.76 74.11,1.71 51.86,1.71 49.34,4.24 49.34,6.99 46.04,10.29 42.02,10.29 39.92,12.38 38.82,12.38 34.82,8.38 29.1,8.38 28.43,7.71 27.94,7.71 27.48,7.71 27.16,7.71 26.08,6.63 26.08,5.76 D8.1
N$9  (via drill 0.7)
  Top 0.305: IC4.3 86.22,61.74 v86.68,61.28 87.59,60.37 87.59,59.18 88.46,58.31 88.46,55.05 v88.9,54.61 | v87,76.52 86.81,76.7 R6.2
  Bottom 0.305: v86.68,61.28 87,61.28 v87,76.52 | v88.9,54.61 89.3,54.21 92.5,54.21 94.25,52.46 94.25,32.19 93.09,31.03 93.09,4.66 90.34,1.91 51.75,1.91 50.48,3.17 50.48,7.62 47.43,10.67 25.21,10.67 23.2,12.68 21.61,12.68 IC3.14
N$10
  Top 0.305: IC2.22 52.09,76.2 59.7,68.59 | 59.7,68.59 59.73,68.56 | 59.7,68.59 59.69,68.58 59.69,66.04 60.96,64.77 IC7.6
N$11  (via drill 0.7)
  Top 0.305: IC4.4 85.51,60.54 v86.68,59.37 87.95,58.1 v87.95,52.39 | v87.95,73.34 87.31,73.98 R7.2
  Bottom 0.305: v87.95,73.34 87.63,73.03 87.63,60.33 v86.68,59.37 | v87.95,52.39 88.75,53.19 92.08,53.19 93.23,52.04 93.23,32.61 92.08,31.45 92.08,5.08 90.17,3.17 52.39,3.17 51.75,3.81 51.75,8.26 48.32,11.68 25.86,11.68 25.08,12.47 25.08,13.34 25.4,13.65 IC3.16
N$12  (via drill 0.7)
  Top 0.305: IC4.5 84.81,59.34 v86.68,57.47 | v88.58,70.48 87.83,71.24 R5.2
  Bottom 0.305: v88.58,70.48 88.27,70.17 88.27,59.67 86.68,58.09 v86.68,57.47 86.68,56.53 86.09,55.94 86.09,55.92 86.04,55.88 86.04,55.24 86.09,55.2 86.09,55.19 87.57,53.7 92.28,53.7 93.74,52.25 93.74,32.4 92.58,31.24 92.58,4.87 90.25,2.54 52.07,2.54 51.12,3.49 51.12,7.94 47.88,11.18 25.65,11.18 IC3.15
N$13  (via drill 0.6, 0.7)
  Top 0.305: IC4.8 86.82,55.74 arc-90 v87,55.56 | 85.06,79.38 R4.2 86.94,79.43 v87,79.38
  Bottom 0.305: v87,79.38 87.95,78.42 87.95,74.93 88.9,73.98 88.9,71.44 88.94,71.39 88.96,71.39 89.49,70.86 89.49,70.11 88.96,69.58 88.94,69.58 88.9,69.53 88.9,59.37 87.59,58.06 87.59,56.72 87,56.13 v87,55.56 87.04,55.52 89.28,55.52 90.08,54.72 92.71,54.72 94.75,52.67 94.75,31.98 93.6,30.82 93.6,4.45 90.42,1.27 51.44,1.27 49.85,2.86 49.85,7.3 46.99,10.16 24.77,10.16 22.86,12.06 21.27,12.06 20.95,12.38 18.73,12.38 17.78,13.34 IC3.13
N$14  (via drill 0.7)
  Top 0.305: v22.54,83.82 22.54,84.45 25.08,87 78.82,87 80.26,85.56 86.21,85.56 89.85,81.92 92.39,81.92 94.3,80.01 94.3,69.22 90.83,65.75 90.83,63.16 88.96,61.29 88.96,59.68 89.78,58.86 89.78,56.26 90.83,55.2 90.83,48.87 91.44,48.26 91.44,46.35 90.81,45.72 88.9,45.72 IC8.P3
  Bottom 0.254: 20.32,77.47 20.32,79.38
  Bottom 0.305: 20.32,77.47 IC2.48 | 20.32,79.38 20.32,81.6 v22.54,83.82
N$15  (via drill 0.7)
  Top 0.305: v20.95,83.82 24.77,87.63 78.91,87.63 80.47,86.07 86.65,86.07 87.63,85.09 | IC8.P4 91.12,44.45 91.95,45.28 91.95,48.47 91.34,49.08 91.34,55.41 90.28,56.47 90.28,59.07 89.47,59.89 89.47,61.08 91.34,62.95 91.34,65.3 94.93,68.9 94.93,80.33 92.71,82.55 90.17,82.55 87.63,85.09 | 87.63,85.09 87.25,85.47
  Bottom 0.305: IC2.49 19.05,79.38 19.81,80.14 19.81,81.81 20.91,82.91 20.91,83.78 v20.95,83.82
N$16  (via drill 0.6)
  Top 0.305: R9.1 v44.13,39.37 | v52.49,81.19 51.89,81.19 49.97,79.27 49.97,72.36 49.28,71.67 v49.28,71.15 | v59.05,81.19 59.05,81.92 59.69,82.55 LED1.A
  Bottom 0.305: v44.13,39.37 43.69,39.81 43.69,42.47 44.04,42.82 44.04,43.54 43.69,43.89 43.69,45.53 32.09,57.12 18.53,57.12 18.38,56.97 17.18,56.97 14.58,59.57 14.58,68.87 17.21,71.5 48.93,71.5 v49.28,71.15 | v52.49,81.19 v59.05,81.19
N$17
  Top 0.305: LED2.A 80.42,31.41 78.74,29.74 78.74,26.04 76.83,24.13 R10.1
N$18
  Top 0.305: LED4.C 45.09,34.29 46.35,35.56 R8.2
N$19
  Top 0.305: D0.1 58.42,7.62 59.05,8.26 70.48,8.26 IC1.D0 73.66,7.62 R11.2
N$20
  Top 0.305: LED4.A 28.32,34.29 24.61,30.58 19.15,30.58 IC3.12
N$23
  Top 0.305: C2.1 74.61,60.65 74.93,60.33 74.93,59.37
  Top 0.61: C3.+ 70.1,51.05 73.66,54.61 73.66,58.1 74.93,59.37 76.72,59.37 U1.3 78.51,59.46 78.74,59.69 78.74,62.23 75.25,65.72 PS1.2
N$24
  Top 0.305: 36.51,50.48 R12.1 37.15,49.85 37.47,50.16 37.47,51.03 38.93,52.49 38.93,55.12 39.37,55.56 39.37,57.69 IC9.CH_PD
N$25
  Top 0.305: J2.2 60.33,58.42 60.33,58.17 60.75,57.75 61,57.75 IC7.VCC
  Top 0.406: 60.33,58.42 J2.2
N$26
  Top 0.305: IC9.RST 36.69,57.55 36.69,53.52 R13.1
N$27
  Top 0.406: 40.66,56.53 IC9.GPIO2 41.82,55.28 43.68,55.28 44.36,55.96 44.36,56.74 47.31,59.69 GPIO2.1
N$28
  Top 0.305: P1.1 P2.1 P3.1 P4.1
  Bottom 0.305: P5.1 P1.1
N$29
  Top 0.305: P10.1 P7.1 P9.1 P8.1 P6.1
  Bottom 0.305: P6.1 P10.1
N$31
  Top 0.305: P20.1 P19.1 P18.1 P17.1 P16.1
  Bottom 0.305: P16.1 P20.1
RESET
  Top 0.305: IC2.RESET 12.7,15.24 15.24,17.78 R1.1
RF-DATA-IN
  Bottom 0.305: IC7.9 60.73,57.15 60.21,56.63 | 60.21,56.63 59.69,56.11 59.69,40.64 60.96,39.37 IC6.7 | 60.21,56.63 55.91,60.94 55.91,61.5 54.61,62.79 IC2.19
RF-DATA-OUT  (via drill 0.6)
  Top 0.305: IC5.P$1 71.78,41.92 71.78,44.09 65.4,50.47 | 65.4,50.47 65.07,50.8 IC2.14 | v64.77,49.85 65.4,50.47
  Bottom 0.305: IC7.4 64.77,69.85 66.36,68.26 66.36,51.44 v64.77,49.85
RX-VCC  (via drill 0.6)
  Top 0.305: IC6.4 63.5,68.58 64.77,68.58 65.09,68.26 C5.2 | C6.2 IC6.5
  Top 0.406: 67.25,64.14 C7.+ | 67.25,64.14 65.72,62.61 65.72,54.29 64.77,53.34 63.5,53.34 v60.96,55.88 IC2.16 | C5.2 66.36,65.02 67.25,64.14
  Bottom 0.305: IC6.5 60.96,44.45 60.2,45.21 60.2,55.12 v60.96,55.88
TR-VCC  (via drill 0.6)
  Top 0.305: 72.45,42.61 72.45,43.18 | 72.45,43.18 72.45,44.14 65.28,51.31 | IC2.15 56.64,51.31 65.28,51.31 | v65.5,51.79 65.28,51.57 65.28,51.31 | 72.45,43.18 72.45,42.48 73.03,41.91 74.3,41.91 IC5.P$2
  Bottom 0.305: IC7.5 64.77,67.31 65.85,66.23 65.85,52.4 65.5,52.05 v65.5,51.79

### Text on the board
tNames: github.com/rosangen/rflink-esplink | H ROSVALL 2017 | 433MHZ | 1WIRE | MEGA 2560 | D3 | D7 | CC2500 | BLINK | 5.0V | 3.3V | Aurel power | D5 | TURN | NRF24L01 | A0 | D | + | - | FOT | RXB6 | Vin | + | G | D9 | PRO MINI | WEMOS D1 MINI | D10 | 3.3V | ESP 12 | GND | 3.3V | GND | 3.3V | RFLINK-ESPLINK v0.9 | GND
bNames: 3.3V | GND
tValues: 1Kx4 | MEGA ESP | MEGA INT | ESP
bRestrict: github.com/rosangen/rflink-esplink